# EAGLE board Control_Logic_V2 (EAGLE 9.6.2)
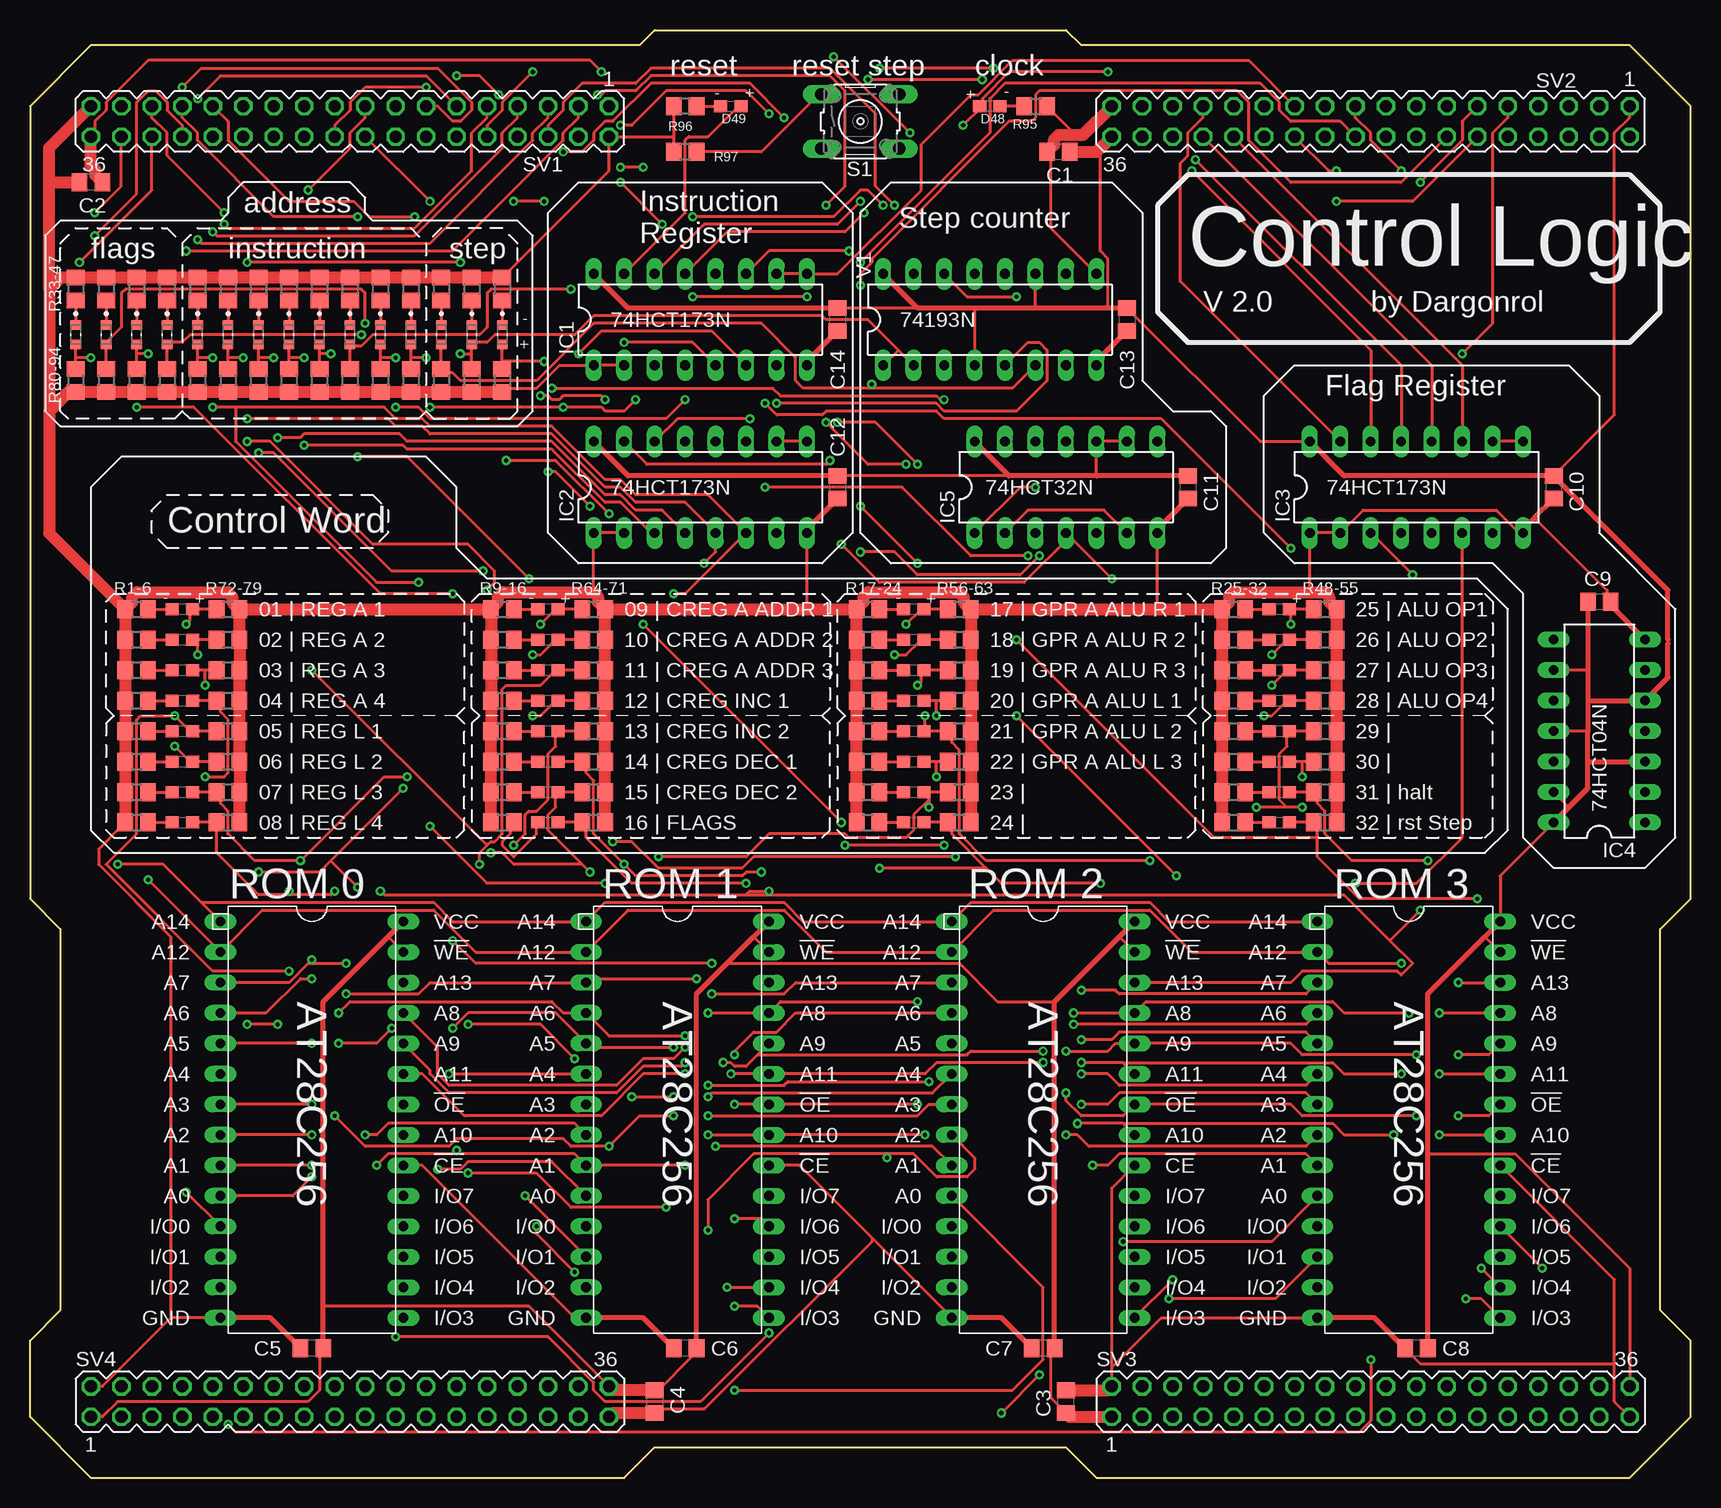
[diagram p3: board, top side]
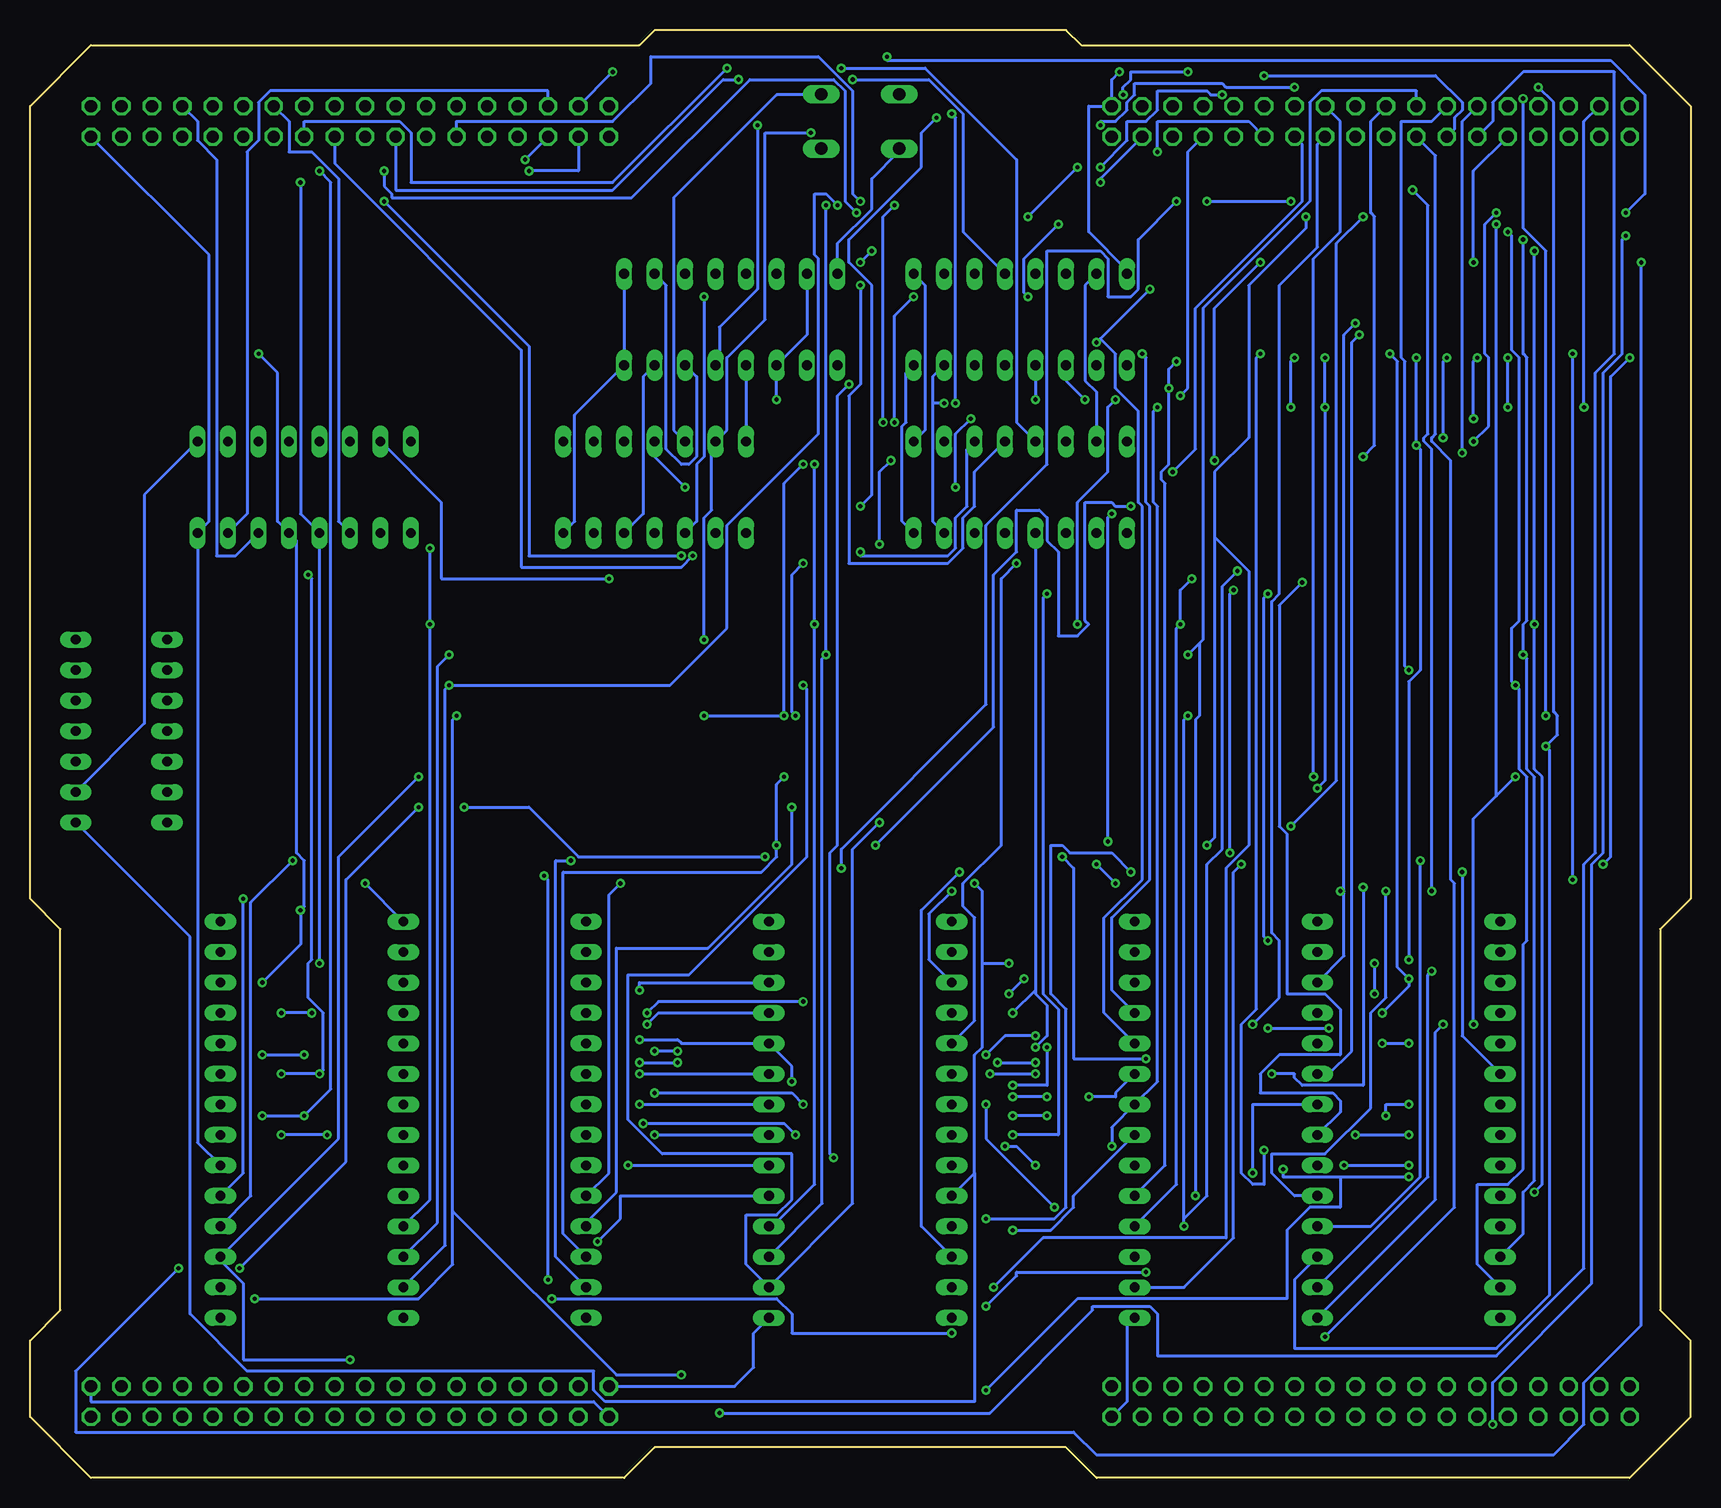
[diagram p4: board, bottom side, seen from below]

Size 138.43 x 120.65 mm. Coordinates in mm from the lower left corner, seen from the top.
Outline: 5.08,0 49.53,0 52.07,2.54 86.36,2.54 88.9,0 133.35,0 138.43,5.08 138.43,11.43 135.89,13.97 135.89,45.72 138.43,48.26 138.43,114.3 133.35,119.38 87.63,119.38 86.36,120.65 52.07,120.65 50.8,119.38 5.08,119.38 0,114.3 0,48.26 2.54,45.72 2.54,13.97 0,11.43 0,5.08 5.08,0
Copper layers (1*16): Top 0.035mm / dielectric 1.5mm / Bottom 0.035mm
Design rules "default *": minimum track width 10mil, minimum drill 0.35mm, track to track 6mil, track to pad 6mil, pad to pad 6mil, via to via 6mil, smd to smd 6mil, copper to edge 40mil, drill to drill 6mil, minimum pad ring 10mil, minimum via ring 8mil, stop-mask expansion 4mil, vias tented up to drill 0mil, thermal gap 10mil

## Footprints (pad centres in the part's own frame; a part is rotated, then mirrored left to right if it is on the bottom)
C0805 = smd 1.3 x 1.5: 1 -0.95,0; 2 0.95,0
0603 = smd 1.1 x 1: 1 -0.85,0; 2 0.85,0
LEDC1608X45N = smd 0.81 x 0.93: A 0.81,0; C -0.81,0
DIL16 = drill 0.813 long: 1 -8.89,-3.81; 2 -6.35,-3.81; 3 -3.81,-3.81; 4 -1.27,-3.81; 5 1.27,-3.81; 6 3.81,-3.81; 7 6.35,-3.81; 8 8.89,-3.81; 9 8.89,3.81; 10 6.35,3.81; 11 3.81,3.81; 12 1.27,3.81; 13 -1.27,3.81; 14 -3.81,3.81; 15 -6.35,3.81; 16 -8.89,3.81
DIL14 = drill 0.813 long: 1 -7.62,-3.81; 2 -5.08,-3.81; 3 -2.54,-3.81; 4 0,-3.81; 5 2.54,-3.81; 6 5.08,-3.81; 7 7.62,-3.81; 8 7.62,3.81; 9 5.08,3.81; 10 2.54,3.81; 11 0,3.81; 12 -2.54,3.81; 13 -5.08,3.81; 14 -7.62,3.81
R0805 = smd 1.3 x 1.5: 1 -0.95,0; 2 0.95,0
B3F-10XX = drill 1.016 long: 1 -3.251,2.261; 2 3.251,2.261; 3 -3.251,-2.261; 4 3.251,-2.261
MA18-2 = drill 1.016 octagon: 1 -21.59,-1.27; 2 -21.59,1.27; 3 -19.05,-1.27; 4 -19.05,1.27; 5 -16.51,-1.27; 6 -16.51,1.27; 7 -13.97,-1.27; 8 -13.97,1.27; 9 -11.43,-1.27; 10 -11.43,1.27; 11 -8.89,-1.27; 12 -8.89,1.27; 13 -6.35,-1.27; 14 -6.35,1.27; 15 -3.81,-1.27; 16 -3.81,1.27; 17 -1.27,-1.27; 18 -1.27,1.27; 19 1.27,-1.27; 20 1.27,1.27; 21 3.81,-1.27; 22 3.81,1.27; 23 6.35,-1.27; 24 6.35,1.27; 25 8.89,-1.27; 26 8.89,1.27; 27 11.43,-1.27; 28 11.43,1.27; 29 13.97,-1.27; 30 13.97,1.27; 31 16.51,-1.27; 32 16.51,1.27; 33 19.05,-1.27; 34 19.05,1.27; 35 21.59,-1.27; 36 21.59,1.27
AT28C256 = drill 0.813 long: !CE 7.62,-5.08; !OE 7.62,0; !WE 7.62,12.7; A0 -7.62,-7.62; A1 -7.62,-5.08; A2 -7.62,-2.54; A3 -7.62,0; A4 -7.62,2.54; A5 -7.62,5.08; A6 -7.62,7.62; A7 -7.62,10.16; A8 7.62,7.62; A9 7.62,5.08; A10 7.62,-2.54; A11 7.62,2.54; A12 -7.62,12.7; A13 7.62,10.16; A14 -7.62,15.24; GND -7.62,-17.78; I/O0 -7.62,-10.16; I/O1 -7.62,-12.7; I/O2 -7.62,-15.24; I/O3 7.62,-17.78; I/O4 7.62,-15.24; I/O5 7.62,-12.7; I/O6 7.62,-10.16; I/O7 7.62,-7.62; VCC 7.62,15.24

## Placement (x,y rotation side)
C1  1µF  [C0805]  85.72,110.49 180 top
C2  1µF  [C0805]  5.08,107.95 180 top
C3  1µF  [C0805]  86.36,6.35 90 top
C4  1µF  [C0805]  52.07,6.35 270 top
C5  100pF  [C0805]  23.5,10.79 180 top
C6  100pF  [C0805]  54.61,10.79 180 top
C7  100pF  [C0805]  84.45,10.79 180 top
C8  100pF  [C0805]  115.57,10.79 180 top
C9  100pF  [C0805]  130.81,73.03 0 top
C10  100pF  [C0805]  127,82.55 270 top
C11  100pF  [C0805]  96.52,82.55 270 top
C12  100pF  [C0805]  67.31,82.55 270 top
C13  100pF  [C0805]  91.44,96.52 270 top
C14  100pF  [C0805]  67.31,96.52 270 top
D1  LTST-C193TBKT-5A  [0603]  12.7,72.39 0 top
D2  LTST-C193TBKT-5A  [0603]  12.7,69.85 0 top
D3  LTST-C193TBKT-5A  [0603]  12.7,67.31 0 top
D4  LTST-C193TBKT-5A  [0603]  12.7,64.77 0 top
D5  LTST-C193TBKT-5A  [0603]  12.7,62.23 0 top
D6  LTST-C193TBKT-5A  [0603]  12.7,59.69 0 top
D7  LTST-C193TBKT-5A  [0603]  12.7,57.15 0 top
D8  LTST-C193TBKT-5A  [0603]  12.7,54.61 0 top
D9  LTST-C193TBKT-5A  [0603]  43.18,72.39 0 top
D10  LTST-C193TBKT-5A  [0603]  43.18,69.85 0 top
D11  LTST-C193TBKT-5A  [0603]  43.18,67.31 0 top
D12  LTST-C193TBKT-5A  [0603]  43.18,64.77 0 top
D13  LTST-C193TBKT-5A  [0603]  43.18,62.23 0 top
D14  LTST-C193TBKT-5A  [0603]  43.18,59.69 0 top
D15  LTST-C193TBKT-5A  [0603]  43.18,57.15 0 top
D16  LTST-C193TBKT-5A  [0603]  43.18,54.61 0 top
D17  LTST-C193TBKT-5A  [0603]  73.66,72.39 0 top
D18  LTST-C193TBKT-5A  [0603]  73.66,69.85 0 top
D19  LTST-C193TBKT-5A  [0603]  73.66,67.31 0 top
D20  LTST-C193TBKT-5A  [0603]  73.66,64.77 0 top
D21  LTST-C193TBKT-5A  [0603]  73.66,62.23 0 top
D22  LTST-C193TBKT-5A  [0603]  73.66,59.69 0 top
D23  LTST-C193TBKT-5A  [0603]  73.66,57.15 0 top
D24  LTST-C193TBKT-5A  [0603]  73.66,54.61 0 top
D25  LTST-C193TBKT-5A  [0603]  104.14,72.39 0 top
D26  LTST-C193TBKT-5A  [0603]  104.14,69.85 0 top
D27  LTST-C193TBKT-5A  [0603]  104.14,67.31 0 top
D28  LTST-C193TBKT-5A  [0603]  104.14,64.77 0 top
D29  LTST-C193TBKT-5A  [0603]  104.14,62.23 0 top
D30  LTST-C193TBKT-5A  [0603]  104.14,59.69 0 top
D31  LTST-C193TBKT-5A  [0603]  104.14,57.15 0 top
D32  LTST-C193TBKT-5A  [0603]  104.14,54.61 0 top
D33  LTST-C193KRKT-5A  [LEDC1608X45N]  39.37,95.25 270 top
D34  LTST-C193KRKT-5A  [LEDC1608X45N]  36.83,95.25 270 top
D35  LTST-C193KRKT-5A  [LEDC1608X45N]  34.29,95.25 270 top
D36  LTST-C193KRKT-5A  [LEDC1608X45N]  31.75,95.25 270 top
D37  LTST-C193KRKT-5A  [LEDC1608X45N]  29.21,95.25 270 top
D38  LTST-C193KRKT-5A  [LEDC1608X45N]  26.67,95.25 270 top
D39  LTST-C193KRKT-5A  [LEDC1608X45N]  24.13,95.25 270 top
D40  LTST-C193KRKT-5A  [LEDC1608X45N]  21.59,95.25 270 top
D41  LTST-C193KRKT-5A  [LEDC1608X45N]  19.05,95.25 270 top
D42  LTST-C193KRKT-5A  [LEDC1608X45N]  16.51,95.25 270 top
D43  LTST-C193KRKT-5A  [LEDC1608X45N]  13.97,95.25 270 top
D44  LTST-C193KRKT-5A  [LEDC1608X45N]  11.43,95.25 270 top
D45  LTST-C193KRKT-5A  [LEDC1608X45N]  8.89,95.25 270 top
D46  LTST-C193KRKT-5A  [LEDC1608X45N]  6.35,95.25 270 top
D47  LTST-C193KRKT-5A  [LEDC1608X45N]  3.81,95.25 270 top
D48  LTST-C193TBKT-5A  [0603]  80.01,114.3 180 top
D49  LTST-C193TBKT-5A  [0603]  58.42,114.3 0 top
IC1  74HCT173N  [DIL16]  55.88,96.52 0 top
IC2  74HCT173N  [DIL16]  55.88,82.55 0 top
IC3  74HCT173N  [DIL16]  115.57,82.55 0 top
IC4  74HCT04N  [DIL14]  130.81,62.23 90 top
IC5  74HCT32N  [DIL14]  86.36,82.55 0 top
R1  560  [R0805]  8.89,72.39 0 top
R2  560  [R0805]  8.89,69.85 0 top
R3  560  [R0805]  8.89,67.31 0 top
R4  560  [R0805]  8.89,64.77 0 top
R5  560  [R0805]  8.89,62.23 0 top
R6  560  [R0805]  8.89,59.69 0 top
R7  560  [R0805]  8.89,57.15 0 top
R8  560  [R0805]  8.89,54.61 0 top
R9  560  [R0805]  39.37,72.39 0 top
R10  560  [R0805]  39.37,69.85 0 top
R11  560  [R0805]  39.37,67.31 0 top
R12  560  [R0805]  39.37,64.77 0 top
R13  560  [R0805]  39.37,62.23 0 top
R14  560  [R0805]  39.37,59.69 0 top
R15  560  [R0805]  39.37,57.15 0 top
R16  560  [R0805]  39.37,54.61 0 top
R17  560  [R0805]  69.85,72.39 0 top
R18  560  [R0805]  69.85,69.85 0 top
R19  560  [R0805]  69.85,67.31 0 top
R20  560  [R0805]  69.85,64.77 0 top
R21  560  [R0805]  69.85,62.23 0 top
R22  560  [R0805]  69.85,59.69 0 top
R23  560  [R0805]  69.85,57.15 0 top
R24  560  [R0805]  69.85,54.61 0 top
R25  560  [R0805]  100.33,72.39 0 top
R26  560  [R0805]  100.33,69.85 0 top
R27  560  [R0805]  100.33,67.31 0 top
R28  560  [R0805]  100.33,64.77 0 top
R29  560  [R0805]  100.33,62.23 0 top
R30  560  [R0805]  100.33,59.69 0 top
R31  560  [R0805]  100.33,57.15 0 top
R32  560  [R0805]  100.33,54.61 0 top
R33  1600  [R0805]  39.37,99.06 270 top
R34  1600  [R0805]  36.83,99.06 270 top
R35  1600  [R0805]  34.29,99.06 270 top
R36  1600  [R0805]  31.75,99.06 270 top
R37  1600  [R0805]  29.21,99.06 270 top
R38  1600  [R0805]  26.67,99.06 270 top
R39  1600  [R0805]  24.13,99.06 270 top
R40  1600  [R0805]  21.59,99.06 270 top
R41  1600  [R0805]  19.05,99.06 270 top
R42  1600  [R0805]  16.51,99.06 270 top
R43  1600  [R0805]  13.97,99.06 270 top
R44  1600  [R0805]  11.43,99.06 270 top
R45  1600  [R0805]  8.89,99.06 270 top
R46  1600  [R0805]  6.35,99.06 270 top
R47  1600  [R0805]  3.81,99.06 270 top
R48  47000  [R0805]  107.95,54.61 0 top
R49  47000  [R0805]  107.95,57.15 0 top
R50  47000  [R0805]  107.95,59.69 0 top
R51  47000  [R0805]  107.95,62.23 0 top
R52  47000  [R0805]  107.95,64.77 0 top
R53  47000  [R0805]  107.95,67.31 0 top
R54  47000  [R0805]  107.95,69.85 0 top
R55  47000  [R0805]  107.95,72.39 0 top
R56  47000  [R0805]  77.47,54.61 0 top
R57  47000  [R0805]  77.47,57.15 0 top
R58  47000  [R0805]  77.47,59.69 0 top
R59  47000  [R0805]  77.47,62.23 0 top
R60  47000  [R0805]  77.47,64.77 0 top
R61  47000  [R0805]  77.47,67.31 0 top
R62  47000  [R0805]  77.47,69.85 0 top
R63  47000  [R0805]  77.47,72.39 0 top
R64  47000  [R0805]  46.99,54.61 0 top
R65  47000  [R0805]  46.99,57.15 0 top
R66  47000  [R0805]  46.99,59.69 0 top
R67  47000  [R0805]  46.99,62.23 0 top
R68  47000  [R0805]  46.99,64.77 0 top
R69  47000  [R0805]  46.99,67.31 0 top
R70  47000  [R0805]  46.99,69.85 0 top
R71  47000  [R0805]  46.99,72.39 0 top
R72  47000  [R0805]  16.51,54.61 0 top
R73  47000  [R0805]  16.51,57.15 0 top
R74  47000  [R0805]  16.51,59.69 0 top
R75  47000  [R0805]  16.51,62.23 0 top
R76  47000  [R0805]  16.51,64.77 0 top
R77  47000  [R0805]  16.51,67.31 0 top
R78  47000  [R0805]  16.51,69.85 0 top
R79  47000  [R0805]  16.51,72.39 0 top
R80  47000  [R0805]  39.37,91.44 270 top
R81  47000  [R0805]  36.83,91.44 270 top
R82  47000  [R0805]  34.29,91.44 270 top
R83  47000  [R0805]  31.75,91.44 270 top
R84  47000  [R0805]  29.21,91.44 270 top
R85  47000  [R0805]  26.67,91.44 270 top
R86  47000  [R0805]  24.13,91.44 270 top
R87  47000  [R0805]  21.59,91.44 270 top
R88  47000  [R0805]  19.05,91.44 270 top
R89  47000  [R0805]  16.51,91.44 270 top
R90  47000  [R0805]  13.97,91.44 270 top
R91  47000  [R0805]  11.43,91.44 270 top
R92  47000  [R0805]  8.89,91.44 270 top
R93  47000  [R0805]  6.35,91.44 270 top
R94  47000  [R0805]  3.81,91.44 270 top
R95  560  [R0805]  83.82,114.3 0 top
R96  560  [R0805]  54.61,114.3 180 top
R97  47000  [R0805]  54.61,110.49 180 top
S1  [B3F-10XX]  69.22,113.03 0 top
SV1  [MA18-2]  26.67,113.03 180 top
SV2  [MA18-2]  111.76,113.03 180 top
SV3  [MA18-2]  111.76,6.35 0 top
SV4  [MA18-2]  26.67,6.35 0 top
U$1  AT28C256  [AT28C256]  23.5,31.11 0 top
U$2  AT28C256  [AT28C256]  53.98,31.11 0 top
U$3  AT28C256  [AT28C256]  84.45,31.11 0 top
U$4  AT28C256  [AT28C256]  114.94,31.11 0 top
V1  74193N  [DIL16]  80.01,96.52 0 top

## Tracks (layer width: path | path; a pad name or v marks a point on that pad's centre or on a via)
!BUS_CLK
  Bottom 0.254: IC3.7 120.33,80.33 120.33,110.49 119.38,111.44 119.38,114.62 118.43,115.57 95.25,115.57 SV2.31
!CTRL_IR_LOAD
  Top 0.254: IC2.9 IC2.10 | IC1.10 IC1.9 67.31,100.33 74.3,107.31 74.3,111.12 78.42,115.25 79.06,115.25 81.92,118.11 101.6,118.11 SV2.23
  Bottom 0.254: IC2.9 63.82,87.31 63.82,99.38 IC1.9
BUS_CLK  (via drill 0.35)
  Top 0.254: 79.38,114.3 79.38,114.94 81.6,117.16 v89.85,117.16 | 79.38,114.3 v77.79,112.71 | 79.38,114.3 D48.2 | v62.23,89.53 75.56,89.53 76.2,88.9 82.23,88.9 84.77,91.44 84.77,93.98 84.14,94.61 83.19,94.61 V1.5
  Bottom 0.254: IC2.7 63.18,79.69 63.18,89.53 | 63.18,89.53 63.18,91.76 IC1.7 | SV2.33 v89.85,117.16 | V1.5 80.96,93.03 80.96,95.89 77.79,99.06 v77.79,112.71 | v62.23,89.53 63.18,89.53
BUS_FLAG_1  (via drill 0.35)
  Top 0.254: IC3.14 111.76,93.98 v96.84,108.9
  Bottom 0.254: v96.84,108.9 92.71,108.9 SV2.34
BUS_FLAG_2  (via drill 0.35)
  Top 0.254: IC3.13 114.3,92.71 v97.16,109.86
  Bottom 0.254: SV2.32 v97.16,109.86
BUS_FLAG_3
  Top 0.254: IC3.12 116.84,92.71 SV2.30
BUS_FLAG_4
  Top 0.254: IC3.11 119.38,92.71 SV2.28
BUS_RESET  (via drill 0.35)
  Top 0.254: IC1.15 54.61,105.41 54.61,111.44 54.93,111.76 56.52,111.76 59.05,114.3 D49.2 | v90.17,74.93 86.68,78.42 | SV2.29 97.79,113.35 96.52,112.08 96.52,110.17 95.89,109.54 95.89,99.69 IC3.15 | IC2.15 51.44,84.45 66.36,84.45 v66.67,84.77 | v67.63,77.79 70.8,74.61 82.87,74.61 86.68,78.42 | 86.68,78.42 IC5.4
  Bottom 0.254: IC2.15 49.53,90.49 50.48,91.44 50.48,99.38 IC1.15 | v90.17,74.93 104.14,74.93 104.14,81.28 IC3.15 | v66.67,84.77 67.63,83.82 v67.63,77.79
CTRL_1  (via drill 0.35)
  Top 0.254: R79.1 D1.2 13.34,72.39 13.34,71.44 v13.02,71.12 | U$1.I/O0 v13.02,23.81 | SV1.3 45.72,113.35 44.45,112.08 44.45,111.44 35.24,102.23 v13.02,102.23
  Bottom 0.254: v13.02,23.81 12.38,24.45 12.38,58.42 13.02,59.05 v13.02,71.12 v13.02,102.23
CTRL_2  (via drill 0.35)
  Top 0.254: R78.1 13.97,69.85 | 13.97,69.85 D2.2 | v13.97,68.58 13.97,69.85 | SV1.5 43.18,113.35 41.91,112.08 41.91,111.44 33.34,102.87 14.29,102.87 v13.97,103.19
  Bottom 0.254: U$1.I/O1 13.97,20.32 13.97,23.81 13.02,24.77 13.02,58.42 13.65,59.05 13.65,68.26 v13.97,68.58 13.97,71.12 13.65,71.44 13.65,93.34 13.97,93.66 v13.97,103.19
CTRL_3  (via drill 0.35)
  Top 0.254: R77.1 14.61,67.31 | 14.61,67.31 D3.2 | v14.61,66.04 14.61,67.31 | SV1.7 40.64,113.35 39.37,112.08 39.37,110.81 32.07,103.5 15.56,103.5 v15.24,103.82
  Bottom 0.254: U$1.I/O2 17.78,17.78 17.78,24.45 15.24,24.45 13.97,25.72 13.97,44.45 13.65,44.77 13.65,58.42 14.29,59.05 14.29,65.72 v14.61,66.04 14.92,66.36 14.92,70.8 14.29,71.44 14.29,93.34 14.92,93.98 14.92,103.5 v15.24,103.82
CTRL_4  (via drill 0.35)
  Top 0.254: D4.2 R76.1 15.88,64.77 15.88,63.82 16.51,63.18 16.51,58.74 16.19,58.42 v14.61,58.42 | v20.64,37.78 v18.1,37.78 | SV1.9 38.1,113.35 36.83,112.08 36.83,108.9 32.07,104.14 16.51,104.14 v16.19,104.46
  Bottom 0.254: 16.19,56.83 18.1,54.93 v18.1,37.78 | 16.19,56.83 v14.61,58.42 | v20.64,37.78 21.27,37.15 21.27,23.18 U$1.I/O3 | 16.19,56.83 v16.19,104.46
CTRL_5  (via drill 0.35)
  Top 0.254: R75.1 D5.2 13.34,62.23 v12.06,63.5 9.21,63.5 8.89,63.18 8.89,53.66 6.35,51.12 15.24,42.23 v21.59,42.23 | SV1.11 33.02,116.84 15.88,116.84 v13.97,114.94
  Bottom 0.254: v21.59,42.23 21.91,41.91 21.91,25.08 U$1.I/O4 | v13.97,114.94 13.97,104.14 12.06,102.23 v12.06,63.5
CTRL_6  (via drill 0.35)
  Top 0.254: R74.1 D6.2 13.34,59.69 v12.06,60.96 | SV1.13 33.97,114.3 35.24,113.03 35.88,113.03 36.83,113.98 36.83,114.62 33.97,117.47 14.29,117.47 v12.7,115.89
  Bottom 0.254: U$1.I/O5 33.02,16.51 33.02,10.79 16.19,10.79 11.75,15.24 11.75,60.64 v12.06,60.96 11.11,61.91 11.11,63.5 11.43,63.82 11.43,114.62 v12.7,115.89
CTRL_7  (via drill 0.35)
  Top 0.254: D7.2 R73.1 15.88,57.15 15.88,56.2 16.51,55.56 16.51,53.66 18.73,51.44 v22.54,51.44 29.53,58.42 v31.43,58.42
  Bottom 0.254: v22.54,51.44 22.54,25.08 26.67,20.95 U$1.I/O6 | SV1.15 29.21,113.03 29.21,103.82 31.43,101.6 v31.43,58.42
CTRL_8  (via drill 0.35)
  Top 0.254: R72.1 D8.2 | R72.1 15.56,52.07 19.05,48.58 21.59,48.58 | 21.59,48.58 25.08,48.58 v25.4,48.9 | R72.1 | SV1.17 27.94,113.35 26.67,112.08 26.67,110.81 v23.18,107.31 | 21.59,48.58 v21.59,48.9
  Bottom 0.254: v25.4,48.9 25.4,40.01 26.67,38.73 26.67,30.8 30.48,26.99 34.92,26.99 34.92,25.4 33.02,23.5 U$1.I/O7 | v23.18,107.31 21.91,106.05 21.91,87 22.23,86.68 22.23,86.36 21.59,85.72 v21.59,48.9
CTRL_9  (via drill 0.35)
  Top 0.254: R71.1 D9.2 43.81,72.39 v42.55,71.12 | v27.3,85.09 31.43,85.09 v41.59,74.93
  Bottom 0.254: U$2.I/O0 42.86,24.45 42.86,70.8 v42.55,71.12 42.55,73.98 v41.59,74.93 | SV1.19 26.67,113.03 26.67,105.41 26.35,105.09 26.35,86.04 v27.3,85.09
CTRL_10  (via drill 0.35)
  Top 0.254: R70.1 D10.2 43.81,69.85 42.55,68.58 v41.91,68.58 | v41.27,23.5 U$2.I/O1
  Bottom 0.254: 40.96,69.53 40.64,69.85 40.64,97.47 31.75,106.36 31.75,114.62 30.8,115.57 22.86,115.57 SV1.21 | 40.96,69.53 v41.91,68.58 | v41.27,23.5 41.27,63.18 40.96,63.5 40.96,69.53
CTRL_11  (via drill 0.35)
  Top 0.254: R69.1 D11.2 43.81,67.31 42.55,66.04 39.69,66.04 39.37,65.72 39.37,53.66 38.73,53.02 38.42,53.02 38.1,52.7 | 38.1,52.7 37.47,52.07 v37.47,51.12 | 38.1,52.7 v23.5,67.31
  Bottom 0.254: v37.47,51.12 38.1,50.48 38.1,20 42.23,15.88 U$2.I/O2 | SV1.23 21.59,113.03 24.13,113.03 24.13,93.34 23.81,93.03 23.81,67.63 v23.5,67.31
CTRL_12  (via drill 0.35)
  Top 0.254: R68.1 D12.2 43.81,64.77 42.55,63.5 v41.91,63.5 | v42.23,20.95 42.23,20.32 v45.4,17.14 | v58.74,14.29 60.64,14.29 U$2.I/O3 | v19.05,85.41 20.32,85.41 30.16,75.56 v37.78,75.56
  Bottom 0.254: v41.91,63.5 42.23,63.18 42.23,21.59 | v42.23,20.95 42.23,21.59 | v45.4,17.14 56.2,17.14 56.2,16.83 v58.74,14.29 | SV1.25 19.05,113.03 v19.05,85.41 | v37.78,75.56 39.05,74.3 39.05,52.39 40.32,51.12 40.32,23.5 42.23,21.59
CTRL_13  (via drill 0.35)
  Top 0.254: R67.1 D13.2 43.81,62.23 43.81,60.96 43.18,60.33 43.18,56.52 42.23,55.56 41.59,55.56 41.27,55.24 41.27,53.66 v40.32,52.7 | v32.07,105.09 28.26,105.09 26.99,106.36 21.59,106.36 16.51,111.44 16.51,113.03 SV1.27 | v58.1,15.88 U$2.I/O4
  Bottom 0.254: v40.32,52.7 39.69,53.34 39.69,78.42 | 39.69,78.42 39.69,83.82 36.83,86.68 36.83,99.38 32.07,104.14 v32.07,105.09 | v58.1,15.88 53.98,20 38.73,20 38.73,50.8 36.83,52.7 36.83,75.56 39.69,78.42
CTRL_14  (via drill 0.35)
  Top 0.254: D14.2 R66.1 46.35,59.69 46.35,58.74 46.99,58.1 46.99,53.66 v49.53,51.12 50.48,50.16 59.37,50.16 59.69,50.48 v60.96,50.48 | SV1.29 12.7,113.35 13.97,112.08 13.97,111.44 20.32,105.09 v27.3,105.09 | v33.34,54.29 38.1,49.53 v47.94,49.53
  Bottom 0.254: v60.96,50.48 64.14,47.31 64.14,20.95 U$2.I/O5 | v27.3,105.09 29.53,102.87 29.53,58.1 v33.34,54.29 | v49.53,51.12 v47.94,49.53
CTRL_15  (via drill 0.35)
  Top 0.254: R65.1 D15.2 43.81,57.15 43.81,55.88 43.18,55.24 43.18,53.98 46.04,51.12 | v46.67,50.48 46.04,51.12 | v58.74,21.59 60.96,21.59 U$2.I/O6 | SV1.31 10.16,113.35 11.43,112.08 11.43,110.17 v16.19,105.41 | v18.1,86.36 20,86.36 28.57,77.79 36.51,77.79 38.73,75.56 38.73,74.61 v38.1,73.98 | v38.42,52.07 39.37,52.07 40.32,51.12 46.04,51.12
  Bottom 0.254: v46.67,50.48 48.26,52.07 51.75,52.07 52.39,52.7 53.34,52.7 53.34,40.32 52.07,39.05 52.07,22.54 53.02,21.59 v58.74,21.59 | v16.19,105.41 17.14,104.46 17.14,93.66 16.83,93.34 16.83,87.63 v18.1,86.36 | v38.1,73.98 38.42,73.66 v38.42,52.07
CTRL_16  (via drill 0.35)
  Top 0.254: D16.2 R64.1 46.35,54.61 46.35,53.34 50.16,49.53 v59.69,49.53 | v8.89,89.22 13.65,89.22 29.21,73.66 v35.24,73.66 | v35.24,44.77 37.15,42.86 v56.83,42.86
  Bottom 0.254: v59.69,49.53 59.05,48.9 59.05,42.86 | 59.05,42.86 59.05,35.88 59.69,35.24 59.69,25.4 | U$2.I/O7 59.69,25.4 | IC4.1 125.09,45.09 125.09,13.65 120.33,8.89 91.44,8.89 91.44,7.3 90.49,6.35 59.69,6.35 59.69,25.4 | SV1.33 8.89,113.03 v8.89,89.22 | v35.24,73.66 35.56,73.34 35.56,45.09 v35.24,44.77 | 59.05,42.86 v56.83,42.86
CTRL_17  (via drill 0.35)
  Top 0.254: R63.1 D17.2 74.3,72.39 v73.03,71.12 | v52.7,104.46 v49.21,107.95 | v64.77,98.42 v55.24,98.42 | v66.36,87.95 69.85,84.45 v73.03,84.45
  Bottom 0.254: U$3.I/O0 76.52,20.95 73.03,24.45 v73.03,71.12 v73.03,84.45 | SV1.4 49.21,108.27 v49.21,107.95 | v52.7,104.46 55.56,101.6 55.56,98.74 v55.24,98.42 | v64.77,98.42 66.36,96.84 v66.36,87.95
CTRL_18  (via drill 0.35)
  Top 0.254: R62.1 D18.2 74.3,69.85 73.03,68.58 v72.07,68.58 | SV1.6 43.18,112.71 44.45,113.98 44.45,114.62 46.04,116.2 50.48,116.2 51.75,117.47 66.67,117.47 70.48,113.67 70.48,107.63 v72.07,106.05
  Bottom 0.254: U$3.I/O1 72.39,22.86 72.39,68.26 v72.07,68.58 v72.07,106.05
CTRL_19  (via drill 0.35)
  Top 0.254: R61.1 D19.2 74.3,67.31 74.3,66.36 v73.98,66.04 | v42.55,90.17 43.18,90.17 43.5,89.85 44.13,89.85 44.45,90.17 47.62,90.17 v47.94,89.85 | v67.63,54.61 v51.12,71.12
  Bottom 0.254: v73.98,66.04 73.66,65.72 73.66,51.75 83.5,41.91 88.58,41.91 88.58,29.84 85.72,26.99 74.93,26.99 74.93,23.18 76.2,21.91 78.74,21.91 78.74,17.78 U$3.I/O2 69.85,22.86 69.85,52.39 v67.63,54.61 | SV1.8 41.91,110.49 41.91,90.81 v42.55,90.17 | v47.94,89.85 48.58,89.22 48.58,83.82 51.12,81.28 v51.12,71.12
CTRL_20  (via drill 0.35)
  Top 0.254: R60.1 75.56,64.77 | 75.56,64.77 D20.2 | v75.56,63.5 75.56,64.77 | v95.57,50.16 v82.23,63.5 | U$3.I/O3 v95.25,16.51 | SV1.10 38.1,112.71 39.37,113.98 39.37,114.62 v41.91,117.16 | v47.31,115.25 47.62,115.25 47.94,115.57 50.48,115.57 51.75,116.84 66.67,116.84 67.94,115.57 67.94,107.63 v66.36,106.05 | v67.31,87.95 70.48,87.95 v73.98,84.45
  Bottom 0.254: v82.23,63.5 v75.56,63.5 75.56,82.87 v73.98,84.45 | v95.57,50.16 95.25,49.85 v95.25,16.51 | v41.91,117.16 46.67,117.16 46.67,116.52 47.31,115.89 v47.31,115.25 | v66.36,106.05 67.31,105.09 v67.31,87.95
CTRL_21  (via drill 0.35)
  Top 0.254: 74.61,62.23 R59.1 76.83,62.23 76.83,61.28 77.47,60.64 77.47,53.66 79.69,51.44 v93.34,51.44 | v44.45,110.49 46.04,110.49 46.99,111.44 46.99,112.08 47.94,113.03 48.58,113.03 51.75,116.2 60.01,116.2 v62.87,113.35 | v73.98,76.2 v69.22,80.96 | 74.61,62.23 v74.61,63.5 | 74.61,62.23 D21.2
  Bottom 0.254: v93.34,51.44 94.61,51.44 94.61,18.41 U$3.I/O4 | SV1.12 36.83,113.03 44.45,113.03 v44.45,110.49 | v62.87,113.35 64.14,112.08 64.14,109.22 70.17,103.19 70.17,101.28 68.26,99.38 68.26,81.92 v69.22,80.96 | v73.98,76.2 74.93,75.25 74.93,63.82 v74.61,63.5
CTRL_22  (via drill 0.35)
  Top 0.254: R58.1 75.56,59.69 | 75.56,59.69 D22.2 | v75.56,58.42 75.56,59.69 | v43.18,83.82 43.81,83.82 v46.67,80.96 | v76.2,52.7 v67.94,52.7
  Bottom 0.254: v75.56,58.42 76.2,57.78 v76.2,52.7 76.2,51.75 77.47,50.48 93.98,50.48 93.98,20.32 U$3.I/O5 | SV1.14 32.38,111.12 32.38,106.36 41.27,97.47 41.27,85.72 v43.18,83.82 | v46.67,80.96 47.94,80.96 48.26,81.28 50.48,81.28 50.48,71.44 50.16,71.12 51.12,70.17 52.7,70.17 52.7,77.15 53.66,78.11 53.66,80.01 54.29,80.64 56.2,80.64 56.2,77.15 58.1,75.25 58.1,62.55 v67.94,52.7
CTRL_23  (via drill 0.35)
  Top 0.254: R57.1 74.93,57.15 74.93,56.52 | v74.93,55.88 74.93,56.52 | v36.51,37.78 42.55,37.78 v45.4,34.92 | v52.39,51.75 59.69,51.75 61.59,53.66 67.94,53.66 68.26,53.34 73.03,53.34 73.66,53.98 73.66,55.24 74.93,56.52
  Top 0.305: v74.93,55.88 74.93,57.15 D23.2
  Bottom 0.254: v74.93,55.88 74.93,51.12 81.92,44.13 89.53,44.13 89.53,23.81 92.08,21.27 U$3.I/O6 | SV1.16 31.11,111.12 31.11,102.55 34.29,99.38 34.29,73.66 34.92,73.03 34.92,45.4 34.29,44.77 34.29,40.01 v36.51,37.78 | v45.4,34.92 51.44,34.92 51.44,50.8 v52.39,51.75
CTRL_24  (via drill 0.35)
  Top 0.254: D24.2 R56.1 76.83,54.61 76.83,53.66 79.69,50.8 | 79.69,50.8 80.96,49.53 v89.22,49.53 | v33.34,106.36 SV1.18 | v42.86,106.36 v40.32,106.36 | 79.69,50.8 v70.8,50.8
  Bottom 0.254: v89.22,49.53 90.17,48.58 90.17,25.4 U$3.I/O7 | v40.32,106.36 v33.34,106.36 | v42.86,106.36 46.04,103.19 46.04,99.06 46.67,98.42 48.58,98.42 48.58,101.6 49.21,102.23 53.66,102.23 53.66,84.45 58.74,79.38 58.74,64.45 70.8,52.39 v70.8,50.8
CTRL_25  (via drill 0.35)
  Top 0.254: R55.1 105.09,72.39 | v105.09,71.12 105.09,72.39 | 105.09,72.39 D25.2 | SV1.20 25.4,112.71 26.67,113.98 26.67,114.62 27.94,115.89 v33.02,115.89 | v49.21,112.71 50.16,112.71 53.02,115.57 59.69,115.57 v61.59,113.67 | v61.28,89.53 62.23,88.58 66.04,88.58 66.36,88.9 75.56,88.9 76.2,88.27 94.3,88.27 v105.09,77.47
  Bottom 0.254: U$4.I/O0 105.09,23.18 v105.09,71.12 v105.09,77.47 | v33.02,115.89 38.73,115.89 39.05,116.2 46.35,116.2 46.35,115.25 46.99,114.62 46.99,113.98 47.94,113.03 49.21,113.03 v49.21,112.71 | v61.59,113.67 61.28,113.35 v61.28,89.53
CTRL_26  (via drill 0.35)
  Top 0.254: R54.1 D26.2 104.78,69.85 v103.5,68.58 | v30.48,11.75 43.18,11.75 46.99,7.94 46.99,7.3 47.94,6.35 55.88,6.35 v61.59,12.06 | v94.93,14.92 103.82,14.92 U$4.I/O1
  Bottom 0.254: v103.5,68.58 104.46,67.63 104.46,21.27 U$4.I/O1 | SV1.22 21.27,110.17 21.27,87 21.59,86.68 21.59,86.36 20,84.77 20,49.85 19.68,49.53 19.68,22.54 v30.48,11.75 | v61.59,12.06 74.93,12.06 74.93,13.65 76.2,14.92 v94.93,14.92
CTRL_27  (via drill 0.35)
  Top 0.254: R53.1 D27.2 104.78,67.31 v103.5,66.04 | v35.56,116.84 37.47,116.84 v39.05,115.25 | v51.12,109.22 v49.21,109.22 | v55.24,105.09 66.99,105.09 69.22,107.31 69.85,107.31 v71.12,106.05
  Bottom 0.254: U$4.I/O2 103.82,19.37 103.82,65.72 v103.5,66.04 85.09,66.04 80.33,70.8 80.33,79.38 72.71,87 72.71,101.6 73.03,101.92 73.03,107 72.07,107 v71.12,106.05 | SV1.24 19.68,112.39 19.68,113.35 19.05,113.98 19.05,114.62 21.27,116.84 v35.56,116.84 | v39.05,115.25 40.01,115.25 40.32,115.57 44.45,115.57 44.45,113.98 45.4,113.03 46.99,113.03 46.99,111.44 v49.21,109.22 | v55.24,105.09 v51.12,109.22
CTRL_28  (via drill 0.35)
  Top 0.254: R52.1 D28.2 104.78,64.77 103.5,63.5 v102.87,63.5 | v119.7,14.92 120.97,14.92 U$4.I/O3 | v84.14,8.57 v80.96,5.4
  Bottom 0.254: v102.87,63.5 103.19,63.18 103.19,22.23 | 103.19,22.23 103.19,17.78 106.05,14.92 v119.7,14.92 | SV1.26 16.51,113.03 16.51,114.62 13.97,117.16 6.35,117.16 6.35,93.66 7.94,92.08 7.94,52.07 8.89,51.12 8.89,17.46 16.19,10.16 44.45,10.16 44.45,13.65 45.09,14.29 49.85,14.29 49.85,13.97 58.42,5.4 v80.96,5.4 | v84.14,8.57 89.53,8.57 103.19,22.23
CTRL_29  (via drill 0.35)
  Top 0.254: R51.1 D29.2 104.78,62.23 104.78,60.96 104.14,60.33 104.14,56.52 104.78,55.88 | v106.05,55.88 104.78,55.88 | U$4.I/O4 v120.97,17.46 | v35.88,101.28 v18.1,101.28 | v39.69,84.77 43.81,84.77 v48.26,80.33 | v48.58,53.02 50.16,53.02 52.39,50.8 59.37,50.8 60.33,51.75 v77.15,51.75 | 104.78,55.88 v102.23,55.88
  Bottom 0.254: v106.05,55.88 112.08,49.85 112.08,26.35 v120.97,17.46 | SV1.28 18.1,108.9 v18.1,101.28 | v35.88,101.28 39.69,97.47 v39.69,84.77 | v48.26,80.33 48.58,80.01 v48.58,53.02 | v77.15,51.75 92.71,51.75 96.84,55.88 v102.23,55.88
CTRL_30  (via drill 0.35)
  Top 0.254: R50.1 106.05,59.69 | 106.05,59.69 D30.2 | v106.05,58.42 106.05,59.69 | SV1.30 12.7,112.71 11.43,113.98 11.43,114.62 10.48,115.57 9.84,115.57 8.89,114.62 8.89,107 v5.4,103.5 | v16.51,4.45 17.14,3.81 110.81,3.81 111.76,4.76 v111.76,9.84
  Bottom 0.254: v106.05,58.42 112.71,51.75 112.71,28.26 U$4.I/O5 122.56,18.1 120.65,16.19 120.65,9.84 v111.76,9.84 | v5.4,103.5 5.71,103.19 5.71,93.66 7.3,92.08 7.3,52.07 8.26,51.12 8.26,16.19 16.51,7.94 v16.51,4.45
CTRL_31  (via drill 0.35)
  Top 0.254: D31.2 R49.1 107.31,57.15 107.31,56.2 107.95,55.56 107.95,53.66 110.17,51.44 v116.52,51.44 | SV1.32 10.16,107.31 v4.13,101.28 | U$4.I/O6 v126.05,17.46
  Bottom 0.254: v116.52,51.44 120.02,47.94 120.02,23.5 U$4.I/O6 | v4.13,101.28 4.13,12.7 8.89,7.94 8.89,4.45 11.43,1.91 49.53,1.91 51.44,3.81 134.62,3.81 134.62,8.89 v126.05,17.46
CTRL_32  (via drill 0.35)
  Top 0.254: D32.2 R48.1 107.31,54.61 107.31,53.34 | 107.31,53.34 107.31,51.75 110.81,48.26 v120.65,48.26 | v82.23,69.85 98.74,53.34 107.31,53.34 | SV1.34 7.62,107.63 v5.4,105.41 | v73.34,112.08 v66.99,118.43
  Bottom 0.254: v120.65,48.26 120.65,25.4 U$4.I/O7 | v82.23,69.85 82.23,80.01 81.6,80.64 81.6,86.04 IC5.13 80.33,87.31 80.33,93.34 77.15,96.52 77.15,112.08 v73.34,112.08 | v5.4,105.41 3.81,107 3.81,115.25 6.67,118.11 66.99,118.11 v66.99,118.43
CTRL_MW  (via drill 0.35)
  Top 0.254: v36.51,25.4 42.23,25.4 45.09,22.54 v53.02,22.54 | v58.74,31.11 U$2.!OE v73.98,31.11 | v115.57,30.16 106.05,30.16 105.09,31.11 U$3.!OE 91.12,30.16 87.63,30.16 86.36,31.43 v86.36,32.07 | v119.06,30.16 121.6,30.16 U$4.!OE | SV2.19 110.49,113.35 111.76,112.08 111.76,111.44 v114.3,108.9
  Bottom 0.254: U$1.!OE 36.51,31.11 v36.51,25.4 | v53.02,22.54 58.74,28.26 v58.74,31.11 | v119.06,30.16 v115.57,30.16 113.35,32.38 113.35,107.95 v114.3,108.9 | v73.98,31.11 74.93,32.07 v86.36,32.07
FLAG_1  (via drill 0.35)
  Top 0.254: R91.1 D44.A 11.43,94.61 12.7,94.61 13.34,95.25 v27.62,95.25 | v84.45,34.61 75.56,34.61 74.61,33.66 U$2.A11 v58.42,33.66 | 91.12,34.61 v87.63,34.61 | U$3.A11 91.12,34.61 | v117.47,33.66 U$4.A11 | v114.3,33.66 109.54,33.66 108.58,34.61 91.12,34.61 | v115.25,75.25 IC3.3 | U$1.A11 32.7,33.66 36.2,30.16 47.62,30.16 51.12,33.66 v54.61,33.66
  Bottom 0.254: v27.62,95.25 28.26,94.61 28.26,35.56 30.16,33.66 U$1.A11 | IC3.3 112.71,79.69 112.71,108.27 114.94,110.49 116.84,110.49 116.84,113.03 SV2.13 | v87.63,34.61 v84.45,34.61 | v117.47,33.66 v114.3,33.66 113.98,33.97 113.98,38.73 115.25,40.01 115.25,42.86 114.94,43.18 114.94,74.93 v115.25,75.25 | v58.42,33.66 v54.61,33.66
FLAG_2  (via drill 0.35)
  Top 0.254: v115.89,107.95 119.38,111.44 119.38,113.03 SV2.11 | R92.1 8.89,93.66 | 8.89,93.66 D45.A | v9.84,93.66 8.89,93.66 | v9.84,49.85 U$1.A12 19.37,47.31 33.66,47.31 37.15,43.81 U$2.A12 49.85,47.31 62.87,47.31 66.36,43.81 U$3.A12 80.33,47.31 93.34,47.31 96.84,43.81 U$4.A12 108.27,42.86 v114.3,42.86
  Bottom 0.254: v115.89,107.95 115.89,80.33 IC3.4 v114.3,42.86 | v9.84,49.85 v9.84,93.66
FLAG_3  (via drill 0.35)
  Top 0.254: R93.1 D46.A 6.35,94.61 7.62,95.89 7.62,98.74 7.94,99.06 27.62,99.06 27.94,98.74 v27.94,96.2 | v61.59,48.9 60.01,48.9 59.69,48.58 | 59.69,48.58 29.53,48.58 v29.21,48.9 | U$3.A13 105.09,41.27 106.05,42.23 113.98,42.23 114.3,41.91 115.25,42.86 113.35,44.77 | 113.35,44.77 109.54,48.58 59.69,48.58 | 113.35,44.77 v115.89,47.31 | v119.06,41.27 U$4.A13 | SV2.9 123.19,113.35 121.92,112.08 121.92,96.2 v119.38,93.66
  Bottom 0.254: v27.94,96.2 28.89,95.25 28.89,48.9 | 28.89,48.9 28.89,43.5 U$1.A13 | U$2.A13 63.5,43.18 63.5,46.99 v61.59,48.9 | 28.89,48.9 v29.21,48.9 | v119.06,41.27 115.89,44.45 v115.89,47.31 115.57,47.62 115.57,51.44 116.2,52.07 116.2,78.11 IC3.5 117.79,79.69 117.79,92.08 v119.38,93.66
FLAG_4  (via drill 0.35)
  Top 0.254: R94.1 3.81,93.34 | 3.81,93.34 D47.A | v5.08,93.34 3.81,93.34 | v7.3,51.12 11.11,51.12 14.29,47.94 | U$1.A14 14.29,47.94 | 14.29,47.94 33.66,47.94 35.24,46.35 U$2.A14 47.94,47.94 62.87,47.94 64.45,46.35 U$3.A14 78.42,47.94 93.34,47.94 94.93,46.35 U$4.A14 | IC3.6 119.38,53.34 115.57,49.53 v110.49,49.53
  Bottom 0.254: IC3.6 121.28,76.83 122.87,76.83 122.87,109.86 124.46,111.44 124.46,113.03 SV2.7 | v5.08,93.34 6.67,91.76 6.67,51.75 v7.3,51.12 | U$4.A14 v110.49,49.53
GND
  Top 0.254: U$1.!CE 32.7,26.04 45.4,13.34 U$2.GND | U$4.!CE 132.08,16.51 132.08,9.53 | 132.08,9.53 132.08,6.35 SV3.35 | U$2.!CE 64.14,26.04 70.17,20 | U$3.GND 70.17,20 | U$3.!CE 90.17,24.13 90.17,9.21 | SV3.2 90.17,9.21 | U$4.GND 94.3,13.34 90.17,9.21 | 132.08,9.53 115.89,9.53 C8.2 | 70.17,20 70.17,19.68 56.2,5.71 52.39,5.71 C4.2 | 125.41,80.01 131.44,73.98 131.44,73.03 C9.2 | R95.2 86.68,112.39 86.68,111.9 | V1.9 85.09,104.14 85.09,110.17 C1.2 | SV4.2 6.03,7.62 11.75,13.34 | U$1.GND 11.75,13.34 | 53.66,111.76 R96.2 | 53.66,111.76 R97.2 | 53.66,111.76 SV1.2 48.26,108.9 39.69,100.33 R33.1 | IC1.2 IC1.1 44.13,92.71 42.23,90.81 39.69,90.81 R80.2 | IC2.2 IC2.1 46.99,74.3 46.96,73.8 | 106.68,73.8 IC3.1 IC3.2 111.12,80.64 122.24,80.64 123.83,79.06 124.46,79.06 | 64.77,72.39 IC2.8 | 93.98,72.39 IC5.7 | 11.75,13.34 11.75,45.09 5.71,51.12 5.71,52.39 7.62,54.29 R8.1
  Top 0.406: C14.2 64.77,93.03 IC1.8 | C13.2 88.9,93.03 V1.8 | C12.2 64.77,79.06 IC2.8 | C11.2 93.98,79.06 IC5.7 | C10.2 125.41,80.01 124.46,79.06 IC3.8 | C9.2 131.76,72.71 IC4.7 | C8.2 112.08,13.34 U$4.GND | C7.2 80.97,13.34 U$3.GND | C6.2 51.12,13.34 U$2.GND | C5.2 20,13.34 U$1.GND
  Top 1.016: R80.2 R81.2 R82.2 R83.2 R84.2 R85.2 R86.2 R87.2 R88.2 R89.2 R90.2 R91.2 R92.2 R93.2 R94.2 3.19,90.49 1.6,88.9 | R33.1 R34.1 R35.1 R36.1 R37.1 R38.1 R39.1 R40.1 R41.1 R42.1 R43.1 R44.1 R45.1 R46.1 R47.1 2.55,100.01 1.6,99.06 | 1.6,99.06 1.6,88.9 | 1.6,88.9 1.6,78.73 R1.1 | R1.1 R2.1 R3.1 R4.1 R5.1 R6.1 R7.1 R8.1 | R72.2 R73.2 R74.2 R75.2 R76.2 R77.2 R78.2 R79.2 | R9.1 R10.1 R11.1 R12.1 R13.1 R14.1 R15.1 R16.1 | R64.2 R65.2 R66.2 R67.2 R68.2 R69.2 R70.2 R71.2 | R24.1 R23.1 R22.1 R21.1 R20.1 R19.1 R18.1 R17.1 | R63.2 R62.2 R61.2 R60.2 R59.2 R58.2 R57.2 R56.2 | R32.1 R31.1 R30.1 R29.1 R28.1 R27.1 R26.1 R25.1 | R48.2 R49.2 R50.2 R51.2 R52.2 R53.2 R54.2 R55.2 108.31,72.98 108.31,73.41 107.92,73.8 106.68,73.8 100.36,73.8 99.97,73.41 99.97,72.98 R25.1 | R1.1 8.53,72.98 8.53,73.41 8.92,73.8 16.48,73.8 16.87,73.41 16.87,72.98 R79.2 | R79.2 R9.1 | R9.1 39.01,72.98 39.01,73.41 39.4,73.8 46.96,73.8 47.35,73.41 47.35,72.98 R71.2 | R71.2 64.77,72.39 R17.1 | R17.1 69.49,72.98 69.49,73.41 69.88,73.8 77.44,73.8 77.83,73.41 77.83,72.98 R63.2 | R63.2 93.98,72.39 R25.1 | 1.6,99.06 1.6,107.95 | 1.6,107.95 1.6,110.82 SV1.35 | 1.6,107.95 C2.2 | C1.2 85.36,111.08 85.36,111.51 85.75,111.9 86.68,111.9 87.77,111.9 SV2.35 | C3.2 89.85,7.3 SV3.2 | C4.2 48.58,5.4 SV4.35
  Bottom 0.254: SV4.35 46.99,6.35 46.99,12.7 U$2.GND | U$3.GND 78.11,12.06 78.11,9.21 79.69,7.62 SV3.2 | SV2.2 123.51,101.92 123.51,79.69 IC3.8 124.46,27.94 U$4.!CE | V1.9 V1.8 93.03,88.58 93.03,79.69 IC5.7 | IC1.8 65.41,92.08 65.41,87.95 65.72,87.63 65.72,79.69 IC2.8
MEMORY_BUS_0  (via drill 0.35)
  Top 0.254: IC1.14 56.2,104.46 67.31,104.46 v69.22,106.36
  Bottom 0.254: v69.22,106.36 69.85,107 69.85,115.57 72.71,118.43 86.68,118.43 86.68,116.2 89.85,113.03 102.87,113.03 SV2.26
MEMORY_BUS_1  (via drill 0.35)
  Top 0.254: IC1.13 58.1,103.82 67.94,103.82 v69.53,105.41 | v108.9,108.9 108.27,108.9 SV2.24
  Bottom 0.254: v69.53,105.41 70.48,106.36 70.48,115.57 71.44,116.52 78.42,116.52 88.27,106.68 108.27,106.68 108.27,107 108.9,107.63 v108.9,108.9
MEMORY_BUS_2  (via drill 0.35)
  Top 0.254: v79.38,116.52 v69.85,116.52
  Bottom 0.254: IC1.12 60.64,103.82 60.64,113.67 63.5,116.52 v69.85,116.52 | v79.38,116.52 80.64,116.52 89.85,107.31 107.95,107.31 SV2.22
MEMORY_BUS_3  (via drill 0.35)
  Top 0.254: IC1.11 61.59,102.23 v68.26,102.23 | v69.22,101.28 80.01,112.08 80.01,114.94 81.28,116.2 102.55,116.2 104.14,114.62 104.14,113.98 105.09,113.03 109.22,113.03 SV2.20
  Bottom 0.254: v69.22,101.28 v68.26,102.23
MEMORY_BUS_4  (via drill 0.35)
  Top 0.254: IC2.14 53.98,88.27 v60.01,88.27 | v61.28,82.55 72.71,82.55 78.42,76.83 v83.19,76.83
  Bottom 0.254: v60.01,88.27 61.28,87 v61.28,82.55 | v83.19,76.83 84.14,75.88 97.47,75.88 97.47,93.98 113.03,109.54 SV2.18
MEMORY_BUS_5  (via drill 0.35)
  Top 0.254: v80.33,117.47 v70.8,117.47
  Bottom 0.254: IC2.13 56.2,87.95 56.2,109.86 63.82,117.47 v70.8,117.47 | v80.33,117.47 89.85,107.95 106.68,107.95 106.68,112.08 107.63,113.03 115.57,113.03 SV2.16
MEMORY_BUS_6  (via drill 0.35)
  Top 0.254: v69.22,99.38 69.22,100.33 70.17,101.28 70.17,101.6 81.6,113.03 83.5,113.03 83.82,113.35 83.82,115.25 84.14,115.57 100.65,115.57 101.6,114.62 101.6,111.44 105.09,107.95 114.3,107.95 SV2.14
  Bottom 0.254: IC2.12 59.69,83.82 59.69,80.96 60.64,80.01 60.64,77.47 61.91,76.2 70.17,76.2 70.17,90.17 69.22,91.12 v69.22,99.38
MEMORY_BUS_7  (via drill 0.35)
  Top 0.254: v69.22,77.15 72.07,77.15 73.98,75.25 82.55,75.25 v84.14,76.83 | v108.9,106.36 115.25,106.36 SV2.12
  Bottom 0.254: IC2.11 60.33,85.72 60.33,80.96 61.28,80.01 61.28,77.47 61.91,76.83 69.22,76.83 v69.22,77.15 | v84.14,76.83 96.84,76.83 96.84,94.3 v108.9,106.36
N$1
  Top 0.254: IC3.9 IC3.10
  Bottom 0.254: IC4.2 128.91,62.87 128.91,81.92 IC3.9
N$2  (via drill 0.35)
  Top 0.254: IC5.1 82.55,82.55 v83.82,82.55
  Bottom 0.254: v83.82,82.55 86.36,85.09 IC5.11
N$3
  Top 0.254: IC5.2 83.19,80.64 89.53,80.64 IC5.6
N$4  (via drill 0.35)
  Top 0.254: v82.23,98.42 78.11,98.42 V1.14
  Bottom 0.254: IC5.3 82.87,79.69 82.87,84.45 82.23,85.09 v82.23,98.42
N$5
  Bottom 0.254: IC5.12 84.77,87.31 84.77,106.68 76.2,115.25 72.71,115.25 S1.2
N$6
  Top 0.254: R97.1 60.96,110.49 65.72,115.25 S1.1
N$7
  Bottom 0.254: IC5.5 87.31,80.33 87.31,91.76 V1.7
N$8
  Top 0.254: R95.1 D48.1
N$9
  Top 0.254: R96.1 D49.1
N$32
  Top 0.254: R1.2 D1.1
N$33
  Top 0.254: R2.2 D2.1
N$34
  Top 0.254: R3.2 D3.1
N$35
  Top 0.254: R4.2 D4.1
N$36
  Top 0.254: R5.2 D5.1
N$37
  Top 0.254: R6.2 D6.1
N$38
  Top 0.254: R7.2 D7.1
N$39
  Top 0.254: R8.2 D8.1
N$40
  Top 0.254: R9.2 D9.1
N$41
  Top 0.254: R10.2 D10.1
N$42
  Top 0.254: R11.2 D11.1
N$43
  Top 0.254: R12.2 D12.1
N$44
  Top 0.254: R13.2 D13.1
N$45
  Top 0.254: R14.2 D14.1
N$46
  Top 0.254: R15.2 D15.1
N$47
  Top 0.254: D16.1 42.23,54.61 42.23,53.66 40.32,51.75 39.37,52.7 39.37,53.02 40.01,53.66 40.01,54.61 R16.2
N$48
  Top 0.254: R17.2 D17.1
N$49
  Top 0.254: R18.2 D18.1
N$50
  Top 0.254: R19.2 D19.1
N$51
  Top 0.254: R20.2 D20.1
N$52
  Top 0.254: R21.2 D21.1
N$53
  Top 0.254: R22.2 D22.1
N$54
  Top 0.254: R23.2 D23.1
N$55
  Top 0.254: R24.2 D24.1
N$56
  Top 0.254: R25.2 D25.1
N$57
  Top 0.254: R26.2 D26.1
N$58
  Top 0.254: R27.2 D27.1
N$59
  Top 0.254: R28.2 D28.1
N$60
  Top 0.254: R29.2 D29.1
N$61
  Top 0.254: R30.2 D30.1
N$62
  Top 0.254: R31.2 D31.1
N$63
  Top 0.254: R32.2 D32.1
N$64
  Top 0.254: R33.2 D33.C
N$65
  Top 0.254: R34.2 D34.C
N$66
  Top 0.254: R35.2 D35.C
N$67
  Top 0.254: R36.2 D36.C
N$68
  Top 0.254: R37.2 D37.C
N$69
  Top 0.254: R38.2 D38.C
N$70
  Top 0.254: R39.2 D39.C
N$71
  Top 0.254: R40.2 D40.C
N$72
  Top 0.254: R41.2 D41.C
N$73
  Top 0.254: R42.2 D42.C
N$74
  Top 0.254: R43.2 D43.C
N$75
  Top 0.254: R44.2 D44.C
N$76
  Top 0.254: R45.2 D45.C
N$93
  Top 0.254: R46.2 D46.C
N$94
  Top 0.254: R47.2 D47.C
OP-CODE_0  (via drill 0.35)
  Top 0.254: v87.63,31.11 89.85,31.11 90.81,32.07 106.36,32.07 U$4.A3 | R83.1 31.75,93.34 | 31.75,93.34 D36.A | v33.02,93.34 31.75,93.34 | v33.34,89.22 v44.45,89.22 47.62,89.22 47.94,88.9 49.53,88.9 v50.48,89.85 | v23.5,31.11 U$1.A3 | v25.4,30.16 27.94,27.62 34.92,27.62 35.56,28.26 44.45,28.26 45.09,27.62 v48.26,27.62 50.8,30.16 v53.66,30.16 | U$3.A3 74.93,31.11 73.98,30.16 v56.52,30.16
  Bottom 0.254: v87.63,31.11 U$3.A3 | v33.02,93.34 33.34,93.03 v33.34,89.22 | v50.48,89.85 52.07,91.44 IC1.3 | v23.5,31.11 25.4,31.11 v25.4,30.16 | v48.26,27.62 48.26,29.21 U$2.A3 44.45,33.02 44.45,80.96 44.77,81.28 44.77,88.9 v44.45,89.22 | v53.66,30.16 v56.52,30.16
OP-CODE_1  (via drill 0.35)
  Top 0.254: v87.63,33.66 89.85,33.66 90.81,32.7 106.36,32.7 U$4.A4 | R84.1 29.21,93.34 | 29.21,93.34 D37.A | v30.48,93.34 29.21,93.34 | v30.48,89.22 32.38,89.22 33.34,88.27 53.02,88.27 v54.61,89.85 | v19.05,50.48 24.13,50.48 25.08,51.44 | v31.11,57.47 25.08,51.44 | v34.92,33.66 U$2.A4 | 25.08,51.44 v27.3,49.21 | U$3.A4 75.25,32.07 56.83,32.07 v56.52,31.75 | v50.16,31.75 v53.66,31.75
  Bottom 0.254: v87.63,33.66 U$3.A4 | v30.48,93.34 v30.48,89.22 30.48,58.1 v31.11,57.47 | IC1.4 v54.61,89.85 | U$1.A4 19.05,36.83 v19.05,50.48 | v34.92,33.66 33.02,33.66 33.02,33.34 32.38,32.7 27.3,32.7 v27.3,49.21 | v53.66,31.75 v56.52,31.75 | v50.16,31.75 47.94,31.75 47.94,32.07 U$2.A4
OP-CODE_2  (via drill 0.35)
  Top 0.254: R85.1 26.67,94.3 | 26.67,94.3 27.62,94.3 28.57,95.25 37.47,95.25 38.1,95.89 38.1,98.74 38.42,99.06 v45.09,99.06 | v49.53,94.61 55.24,94.61 IC1.5 | 26.67,94.3 D38.A | v87.63,36.51 90.17,36.51 90.81,37.15 106.36,37.15 U$4.A5 | v23.5,36.2 U$1.A5 | v25.72,36.2 28.89,36.2 v30.16,37.47 | v35.24,37.47 36.51,38.73 43.81,38.73 U$2.A5 46.67,35.88 v53.66,35.88 | v74.93,33.02 63.18,33.02 62.87,32.7 v56.52,32.7
  Bottom 0.254: v49.53,94.61 49.21,94.93 | 49.21,94.93 v45.09,99.06 | v87.63,36.51 84.45,36.51 84.14,36.2 U$3.A5 74.93,34.29 v74.93,33.02 | v25.72,36.2 v23.5,36.2 | v35.24,37.47 v30.16,37.47 | v56.52,32.7 53.66,32.7 v53.66,35.88 | 49.21,94.93 47.94,93.66 47.94,90.81 46.04,88.9 46.04,81.28 45.72,80.96 45.72,49.85 48.9,46.67 48.9,38.73 U$2.A5
OP-CODE_3  (via drill 0.35)
  Top 0.254: v87,37.78 106.36,37.78 U$4.A6 | R86.1 24.13,93.66 | 24.13,93.66 D39.A | v25.08,93.66 24.13,93.66 | v23.5,41.59 22.54,41.59 19.68,38.73 U$1.A6 | v25.72,38.73 26.67,39.69 43.5,39.69 44.45,38.73 U$2.A6 48.26,36.83 v54.61,36.83 | IC1.6 56.83,95.57 47.62,95.57 v45.72,93.66 | U$3.A6 63.82,38.73 62.23,37.15 60.33,37.15 58.74,35.56 v58.74,35.24
  Bottom 0.254: U$3.A6 86.04,38.73 v87,37.78 | v25.08,93.66 24.45,93.03 24.45,42.55 v23.5,41.59 23.5,40.96 v25.72,38.73 | v45.72,93.66 45.4,93.34 45.4,81.28 45.09,80.96 45.09,49.85 48.26,46.67 48.26,40.64 U$2.A6 | v58.74,35.24 57.15,36.83 v54.61,36.83
OP-CODE_4  (via drill 0.35)
  Top 0.254: v87.63,40.64 90.49,40.64 90.81,40.32 106.36,40.32 U$4.A7 | R87.1 21.59,93.34 | 21.59,93.34 D40.A | v22.86,93.34 21.59,93.34 | v22.86,86.04 31.11,86.04 31.43,85.72 43.5,85.72 47.94,81.28 49.21,81.28 51.75,78.74 IC2.3 | U$1.A7 21.59,41.27 23.18,42.86 | v23.5,43.18 23.18,42.86 | v26.35,40.32 32.38,40.32 33.34,41.27 U$2.A7 46.67,41.59 v55.56,41.59 | 23.18,42.86 v26.35,42.86 | U$3.A7 63.82,41.27 62.87,40.32 v56.83,40.32
  Bottom 0.254: U$3.A7 87.63,41.27 v87.63,40.64 | v22.86,93.34 v22.86,86.04 22.54,85.72 22.54,67.31 23.5,66.36 v23.5,43.18 | v26.35,42.86 v26.35,40.32 | v55.56,41.59 v56.83,40.32
OP-CODE_5  (via drill 0.35)
  Top 0.254: R88.1 19.05,93.34 | 19.05,93.34 D41.A | v20.32,93.34 19.05,93.34 | v20.64,86.68 22.54,86.68 22.86,87 30.8,87 31.43,86.36 43.5,86.36 47.94,81.92 49.21,81.92 50.48,80.64 52.7,80.64 IC2.4 | U$1.A8 33.97,35.88 33.97,33.66 34.92,32.7 48.9,32.7 51.12,34.92 53.66,34.92 v54.61,35.88 | v56.52,38.73 U$2.A8 62.55,39.69 v73.98,39.69 | v87,38.73 U$3.A8 93.03,39.69 108.58,39.69 109.54,38.73 v114.94,38.73 | v117.47,38.73 U$4.A8
  Bottom 0.254: v20.32,93.34 20.64,93.03 v20.64,86.68 | v54.61,35.88 53.66,36.83 53.66,39.37 54.61,40.32 54.61,40.64 | IC2.4 54.61,40.64 | 54.61,40.64 v56.52,38.73 | v87,38.73 86.04,39.69 v73.98,39.69 | v114.94,38.73 v117.47,38.73
OP-CODE_6  (via drill 0.35)
  Top 0.254: R89.1 16.51,93.34 | 16.51,93.34 D42.A | v17.78,93.34 16.51,93.34 | v18.1,88.27 29.84,88.27 30.48,87.63 32.7,87.63 33.34,87 43.5,87 47.94,82.55 49.21,82.55 50.48,81.28 54.61,81.28 IC2.5 57.15,77.15 v56.2,76.2 | v115.57,35.24 106.05,35.24 105.09,36.2 U$3.A9 90.49,36.2 89.85,35.56 v86.36,35.56 | v119.06,35.24 121.6,35.24 U$4.A9 | U$1.A9 33.34,33.97 33.34,33.66 34.92,32.07 48.9,32.07 51.12,34.29 54.29,34.29 v54.61,34.61 | v57.78,34.61 58.42,34.61 58.74,34.29 59.69,34.29 60.64,35.24 | U$2.A9 60.64,35.24 | v84.45,35.56 78.42,35.56 78.11,35.24 60.64,35.24
  Bottom 0.254: v17.78,93.34 18.1,93.03 v18.1,88.27 | v119.06,35.24 v115.57,35.24 | v57.78,34.61 v54.61,34.61 | v84.45,35.56 v86.36,35.56 | v56.2,76.2 57.47,74.93 57.47,52.7 60.64,49.53 60.64,47.62 59.69,46.67 59.69,38.1 U$2.A9
OP-CODE_7  (via drill 0.35)
  Top 0.254: v74.61,28.57 U$2.A10 v56.52,28.57 | 91.12,29.53 v87.31,29.53 | U$3.A10 91.12,29.53 | v117.47,28.57 U$4.A10 | v113.67,28.57 109.54,28.57 108.58,29.53 91.12,29.53 | R90.1 13.97,93.34 | 13.97,93.34 D43.A | v15.24,93.34 13.97,93.34 | 17.14,89.22 29.53,89.22 30.48,88.27 32.7,88.27 33.34,87.63 43.5,87.63 47.94,83.19 49.21,83.19 50.48,81.92 56.52,81.92 IC2.6 54.61,73.66 v53.66,73.66 | 17.14,89.22 v15.24,89.22 | v32.38,74.61 28.89,74.61 17.14,86.36 17.14,89.22
  Bottom 0.254: v74.61,28.57 75.56,29.53 v87.31,29.53 | v113.67,28.57 v117.47,28.57 | v15.24,89.22 v15.24,93.34 | U$1.A10 29.21,30.48 29.21,31.43 29.84,32.07 35.88,32.07 35.88,33.66 34.29,35.24 29.21,35.24 29.21,39.05 30.48,40.32 33.66,40.32 33.66,53.66 34.29,54.29 34.29,72.71 v32.38,74.61 | v56.52,28.57 52.7,28.57 52.7,39.05 53.98,40.32 53.98,73.34 v53.66,73.66
STEP_0  (via drill 0.35)
  Top 0.254: v91.12,19.68 103.5,19.68 U$4.A0 | R80.1 39.37,93.03 | 39.37,93.03 D33.A | v42.86,93.03 39.37,93.03 | U$1.A0 21.91,23.5 v23.5,25.08 | v33.97,25.72 35.88,25.72 36.51,26.35 43.5,26.35 U$2.A0 | v76.2,89.85 75.88,89.85 75.56,90.17 62.55,90.17 61.91,90.81 v43.5,90.81 | U$3.A0 84.45,15.88 84.45,9.84 81.92,7.3 v58.74,7.3
  Bottom 0.254: U$3.A0 89.22,23.5 89.22,21.59 v91.12,19.68 | V1.15 73.66,95.25 V1.3 v76.2,89.85 | v42.86,93.03 43.5,92.39 v43.5,90.81 43.5,84.45 44.13,83.82 44.13,83.19 43.81,82.87 43.81,26.04 U$2.A0 | 29.21,25.08 33.97,25.08 v33.97,25.72 | 29.21,25.08 v23.5,25.08 | v58.74,7.3 51.12,14.92 33.66,14.92 33.66,20.64 31.75,22.54 29.21,22.54 29.21,25.08
STEP_1  (via drill 0.35)
  Top 0.254: R81.1 36.83,93.66 | 36.83,93.66 D34.A 36.83,94.61 38.1,94.61 38.73,95.25 45.4,95.25 46.99,96.84 66.04,96.84 66.36,96.52 69.85,96.52 72.39,93.98 | V1.2 72.39,93.98 | 72.39,93.98 V1.1 | v23.5,26.04 U$1.A1 | v28.89,26.04 29.84,26.99 35.56,26.99 | 35.56,26.99 45.4,26.99 U$2.A1 v54.61,26.04 | v88.58,26.04 89.85,26.04 90.81,26.99 106.36,26.99 U$4.A1 | v57.15,27.62 75.25,27.62 U$3.A1 | v35.88,93.66 36.83,93.66 | 35.56,26.99 v35.56,27.3
  Bottom 0.254: v28.89,26.04 v23.5,26.04 | v88.58,26.04 U$3.A1 | v54.61,26.04 56.2,27.62 v57.15,27.62 | v35.88,93.66 36.2,93.34 36.2,39.05 37.47,37.78 37.47,25.4 36.51,24.45 35.56,24.45 v35.56,27.3
STEP_2  (via drill 0.35)
  Top 0.254: D35.A R82.1 34.29,92.08 35.24,92.08 35.88,91.44 42.23,91.44 46.99,96.2 60.96,96.2 63.82,93.34 63.82,91.44 64.45,90.81 70.17,90.81 | 70.17,90.81 81.92,90.81 V1.6 | v23.5,28.57 U$1.A2 | v27.94,28.57 28.89,28.57 29.84,29.53 45.4,29.53 U$2.A2 | v86.36,28.57 87.31,28.57 88.27,27.62 106.36,27.62 U$4.A2 | v56.52,20.64 56.52,23.18 60.33,26.99 71.44,26.99 | 71.44,26.99 73.66,26.99 75.56,25.08 78.11,25.08 78.74,25.72 78.74,26.67 U$3.A2 | v70.17,91.12 70.17,90.81 | 71.44,26.99 v71.44,26.67
  Bottom 0.254: V1.10 85.41,99.38 85.41,85.72 84.14,84.45 83.5,84.45 82.87,85.09 82.87,91.76 V1.6 | v27.94,28.57 v23.5,28.57 | v86.36,28.57 U$3.A2 | U$2.A2 51.44,23.5 51.44,22.54 53.34,20.64 v56.52,20.64 | v70.17,91.12 71.12,90.17 71.12,52.7 71.75,52.07 71.75,26.99 v71.44,26.67
VCC  (via drill 0.35)
  Top 0.254: 90.81,45.09 U$3.!WE | C7.1 85.09,10.79 85.09,6.67 86.04,5.71 C3.1 | 60.33,45.09 U$2.!WE | 29.84,45.09 U$1.!WE | 24.45,14.29 41.59,14.29 SV4.36 | C6.1 55.24,10.79 55.24,10.16 52.39,7.3 C4.1 | SV4.1 6.03,5.08 7.3,6.35 23.18,6.35 24.13,7.3 24.13,10.79 C5.1 | 85.41,39.69 80.64,39.69 77.47,42.86 58.1,42.86 | 121.28,45.09 U$4.!WE | U$4.VCC 122.56,50.16 IC4.14 | 128.27,55.88 IC4.13 | 129.86,62.23 IC4.11 | 129.86,67.31 IC4.9 | SV3.36 133.35,17.46 123.83,26.99 116.52,26.99 | v47.62,117.16 46.67,118.11 9.84,118.11 6.35,114.62 6.35,113.98 5.4,113.03 5.4,112.08 SV1.36 | SV2.1 133.35,113.35 132.08,112.08 132.08,88.58 C10.1 | IC5.9 IC5.10 88.9,83.5 | 78.74,97.47 V1.4 | 83.82,97.47 V1.11 | 89.85,97.47 89.85,101.6 89.22,102.23 89.22,110.17 88.9,110.49 | 81.6,83.5 C12.1 | IC3.16 102.55,86.36 C13.1 | 73.98,97.47 C14.1 | 136.53,69.53 136.53,69.85 | C10.1 136.53,73.98 | C10.1
  Top 0.406: C14.1 49.85,97.47 IC1.16 | C13.1 89.85,97.47 83.82,97.47 78.74,97.47 73.98,97.47 V1.16 | C12.1 49.85,83.5 IC2.16 | C11.1 88.9,83.5 81.6,83.5 IC5.14 | C10.1 109.54,83.5 IC3.16 | 129.86,64.77 129.86,67.31 C9.1 | 129.86,64.77 129.86,62.23 129.86,59.69 | IC4.14 128.27,55.88 129.86,57.47 129.86,59.69 | C8.1 116.52,26.99 116.52,40.32 121.28,45.09 U$4.VCC | C7.1 85.41,39.69 90.81,45.09 U$3.VCC | C6.1 55.56,40.32 58.1,42.86 60.33,45.09 U$2.VCC | C5.1 24.45,14.29 24.45,39.69 29.84,45.09 U$1.VCC | 129.86,59.69 IC4.3 | 129.86,64.77 IC4.5 136.53,66.67 136.53,69.53 | 136.53,69.85 136.53,73.98 128.11,82.4 | 128.11,82.4 | 128.11,82.4 127.9,82.61 | 127.9,82.61 | 127.9,82.61 C10.1
  Top 1.016: C2.1 5.44,108.54 5.44,108.97 5.08,109.33 SV1.36 | C1.1 88.9,110.49 SV2.36 | C3.1 86.68,5.08 SV3.1 | C4.1 48.58,7.3 SV4.36
  Bottom 0.254: IC1.16 46.99,100.65 50.16,103.82 50.16,114.3 SV1.1 48.26,116.52 v47.62,117.16 | V1.16 71.12,102.87 68.26,105.73 68.26,108.27 66.04,110.49 S1.3 | V1.4 IC5.14 | SV3.1 91.44,6.35 133.35,6.35 SV3.36

## Text on the board
tPlace: reset | reset step | clock | - | + | + | - | address | Step counter | Instruction / Register | flags | instruction | step | Control Logic | R33-47 | V 2.0 | by Dargonrol | - | + | R80-94 | Flag Register | Control Word | R1-6 | R72-79 | R9-16 | R64-71 | R17-24 | R56-63 | R25-32 | R48-55 | - | + | - | + | - | + | - | + | 01 | REG A 1 | 09 | CREG A ADDR 1 | 17 | GPR A ALU R 1 | 25 | ALU OP1 | 02 | REG A 2 | 10 | CREG A ADDR 2 | 18 | GPR A ALU R 2 | 26 | ALU OP2 | 03 | REG A 3 | 11 | CREG A ADDR 3 | 19 | GPR A ALU R 3 | 27 | ALU OP3 | 04 | REG A 4 | 12 | CREG INC 1 | 20 | GPR A ALU L 1 | 28 | ALU OP4 | 05 | REG L 1 | 13 | CREG INC 2 | 21 | GPR A ALU L 2 | 29 | | 06 | REG L 2 | 14 | CREG DEC 1 | 22 | GPR A ALU L 3 | 30 | | 07 | REG L 3 | 15 | CREG DEC 2 | 23 | | 31 | halt | 08 | REG L 4 | 16 | FLAGS | 24 | | 32 | rst Step | ROM 0 | ROM 1 | ROM 2 | ROM 3